# Altium project QUTMS_PDM.PrjPcb
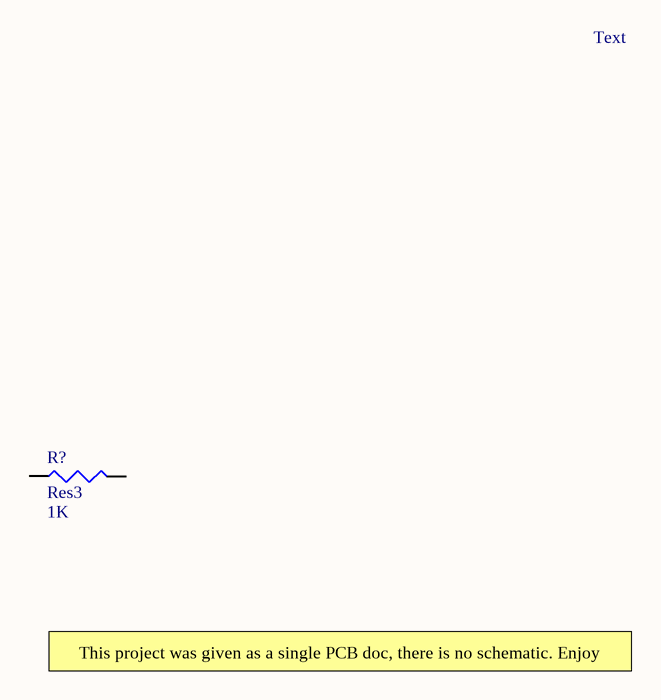
[diagram p0: PDMTest.SchDoc]
5 sheets, 42 parts. Net scope: flat (ports and power ports of the same name join across sheets).
Board file: PMM_MSPC_22A.PcbDoc
Sheets:
  PDMTest.SchDoc
  MCU.SchDoc
  Outputs.SchDoc
  CANBUS.SchDoc
  Power.SchDoc

## Sheet PDMTest.SchDoc
size A4

### Parts
R?  Res3  value 1K  [12Z-2010]

### Nets

Not connected (* = marked no-connect by the designer): R? 1 2

### Notes on the sheet
- Text
- This project was given as a single PCB doc, there is no schematic. Enjoy

### Library data of the parts
R? = Res3: Resistor; Published: 8-Jun-2000; LatestRevisionDate: 29-May-2009; LatestRevisionNote: IPC-7351 Footprint Added.; PackageReference: J1-0603; Publisher: Altium Limited; PackageDescription: Chip Resistor

## Sheet MCU.SchDoc
size A4
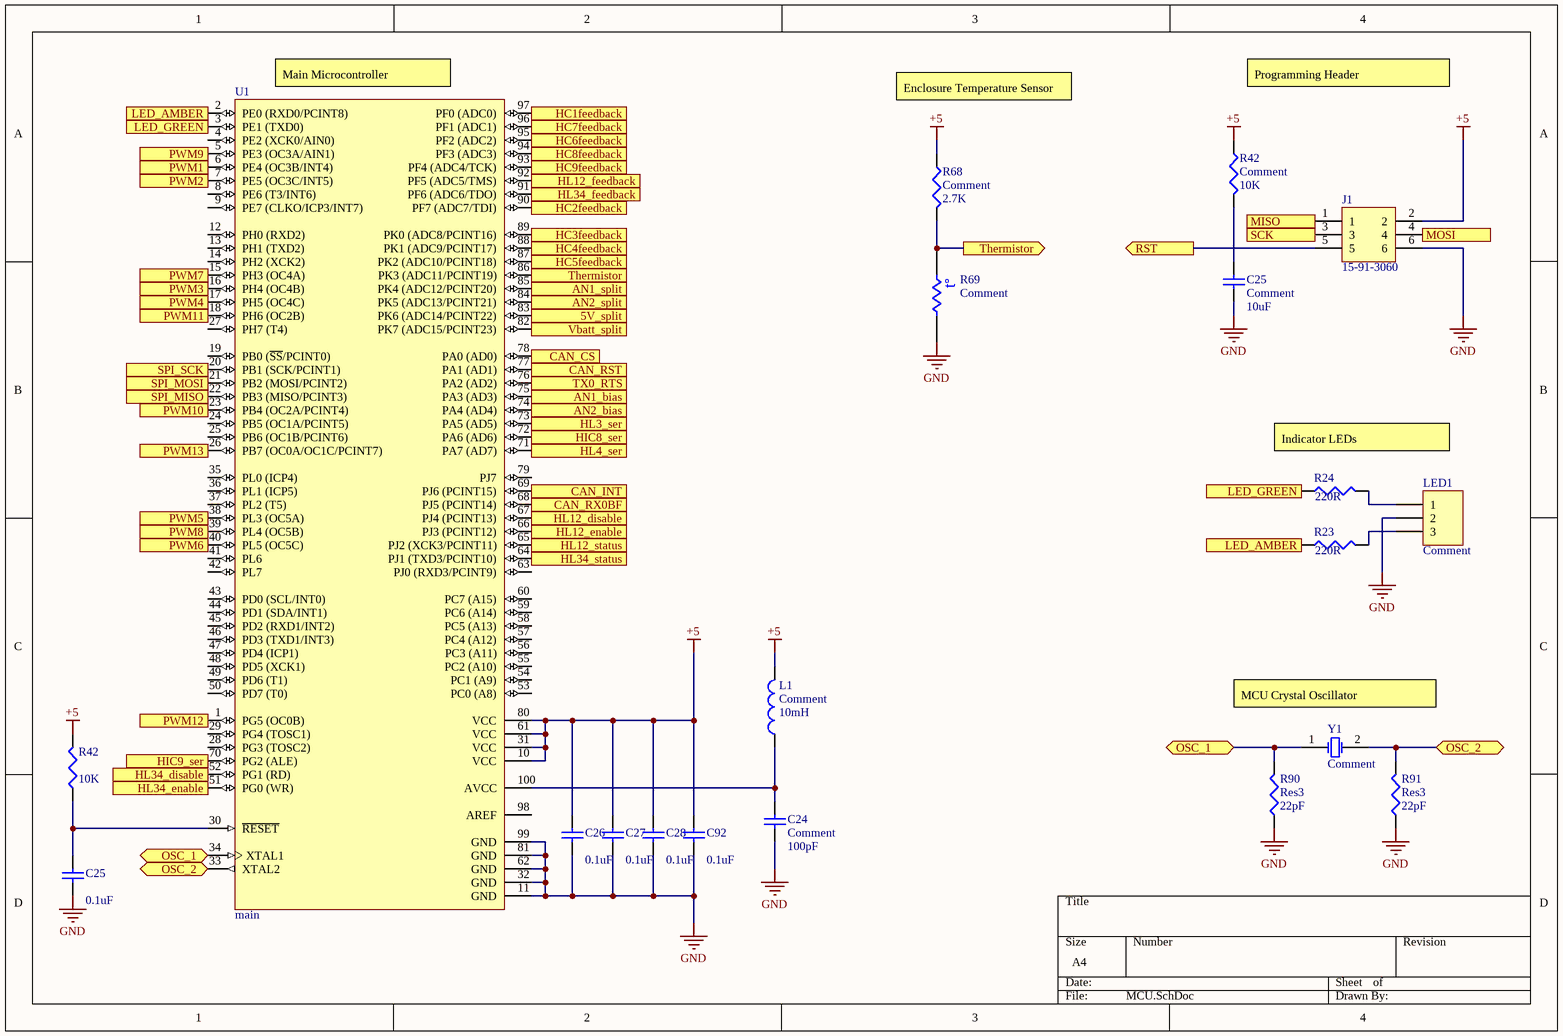
[diagram p1: MCU.SchDoc]

### Parts
(Parts that share a designator on the sheet are numbered #1, #2 ... from top to bottom, then left to right.)
C24  Comment  value 100pF  [J1-0603]
C25#1  Comment  value 10uF  [J1-0603]
C25#2  value 0.1uF  [0402]  (hidden comment: Cap Semi)
C26  value 0.1uF  [J1-0603]  (hidden comment: Comment)
C27  value 0.1uF  [J1-0603]  (hidden comment: Comment)
C28  value 0.1uF  [J1-0603]  (hidden comment: Comment)
C92  value 0.1uF  [J1-0603]  (hidden comment: Comment)
J1  15-91-3060  [SOT23-6]
L1  Comment  value 10mH  [2012[0805]]
LED1  Comment  [369-03]
R23  value 220R  [2012[0805]]  (hidden comment: Comment)
R24  value 220R  [2012[0805]]  (hidden comment: Comment)
R42#1  Comment  value 10K  [2012[0805]]
R42#2  value 10K  [12Z-2010]  (hidden comment: Res3)
R68  Comment  value 2.7K  [2012[0805]]
R69  Comment  [2012[0805]]
R90  Res3  value 22pF  [12Z-2010]
R91  Res3  value 22pF  [J1-0603]
U1  main  [SOT407-1_L]
Y1  Comment  [2012[0805]]

### Ports
5V_split (in), AN1_bias, AN1_split (in), AN2_bias, AN2_split (in), CAN_CS (out), CAN_INT (in), CAN_RST (out), CAN_RX0BF (in), HC1feedback (in), HC2feedback (in), HC3feedback (in), HC4feedback (in), HC5feedback (in), HC6feedback (in), HC7feedback (in), HC8feedback (in), HC9feedback (in), HIC8_ser, HIC9_ser, HL3_ser, HL4_ser, HL12_disable (out), HL12_enable (out), HL12_feedback (in), HL12_status (in), HL34_disable (out), HL34_enable (out), HL34_feedback (in), HL34_status (in), LED_AMBER (in), LED_AMBER (out), LED_GREEN (in), LED_GREEN (out), MISO (in), MOSI (out), OSC_1 (bidir), OSC_2 (bidir), PWM1 (out), PWM2 (out), PWM3 (out), PWM4 (out), PWM5 (out), PWM6 (out), PWM7 (out), PWM8 (out), PWM9 (out), PWM10 (out), PWM11 (out), PWM12 (out), PWM13 (out), RST (out), SCK (out), SPI_MISO (in), SPI_MOSI (out), SPI_SCK, Thermistor (in), Thermistor (out), TX0_RTS, Vbatt_split (in)

### Nets
+5: C26.2 C27.2 C28.2 C92.1 J1.2 L1.1 R42#1.1 R42#2.2 R68.2 U1.10(VCC) U1.31(VCC) U1.61(VCC) U1.80(VCC)
GND: C24.1 C25#1.1 C25#2.1 C26.1 C27.1 C28.1 C92.2 J1.6 LED1.2 R69.2 R90.1 R91.1 U1.11(GND) U1.32(GND) U1.62(GND) U1.81(GND) U1.99(GND)
NetC24_2: C24.2 L1.2 U1.100(AVCC)
NetC25#1_2: C25#1.2 R42#1.2
NetC25#2_2: C25#2.2 R42#2.1 U1.30(~{RESET})
NetJ1_1: J1.1 ; port MISO
NetJ1_3: J1.3 ; port SCK
NetJ1_4: J1.4 ; port MOSI
NetJ1_5: J1.5 ; port RST
NetLED1_1: LED1.1 R24.2
NetLED1_3: LED1.3 R23.2
NetR23_1: R23.1 U1.2(PE0_(RXD0/PCINT8)) ; port LED_AMBER
NetR24_1: R24.1 U1.3(PE1_(TXD0)) ; port LED_GREEN
NetR30_2: U1.68(PJ5_(PCINT14)) ; port CAN_RX0BF
NetR31_2: U1.69(PJ6_(PCINT15)) ; port CAN_INT
NetR32_1: U1.20(PB1_(SCK/PCINT1)) ; port SPI_SCK
NetR33_1: U1.21(PB2_(MOSI/PCINT2)) ; port SPI_MOSI
NetR34_1: U1.22(PB3_(MISO/PCINT3)) ; port SPI_MISO
NetR35_1: U1.78(PA0_(AD0)) ; port CAN_CS
NetR68_1: R68.1 R69.1 U1.86(PK3_(ADC11/PCINT19)) ; port Thermistor
NetR90_2: R90.2 U1.34(XTAL1) Y1.1(OSC1) ; port OSC_1
NetR91_2: R91.2 U1.33(XTAL2) Y1.2(OSC2) ; port OSC_2
NetU1_1: U1.1(PG5_(OC0B)) ; port PWM12
NetU1_5: U1.5(PE3_(OC3A/AIN1)) ; port PWM9
NetU1_6: U1.6(PE4_(OC3B/INT4)) ; port PWM1
NetU1_7: U1.7(PE5_(OC3C/INT5)) ; port PWM2
NetU1_15: U1.15(PH3_(OC4A)) ; port PWM7
NetU1_16: U1.16(PH4_(OC4B)) ; port PWM3
NetU1_17: U1.17(PH5_(OC4C)) ; port PWM4
NetU1_18: U1.18(PH6_(OC2B)) ; port PWM11
NetU1_23: U1.23(PB4_(OC2A/PCINT4)) ; port PWM10
NetU1_26: U1.26(PB7_(OC0A/OC1C/PCINT7)) ; port PWM13
NetU1_38: U1.38(PL3_(OC5A)) ; port PWM5
NetU1_39: U1.39(PL4_(OC5B)) ; port PWM8
NetU1_40: U1.40(PL5_(OC5C)) ; port PWM6
NetU1_51: U1.51(PG0_(WR)) ; port HL34_enable
NetU1_52: U1.52(PG1_(RD)) ; port HL34_disable
NetU1_64: U1.64(PJ1_(TXD3/PCINT10)) ; port HL34_status
NetU1_65: U1.65(PJ2_(XCK3/PCINT11)) ; port HL12_status
NetU1_66: U1.66(PJ3_(PCINT12)) ; port HL12_enable
NetU1_67: U1.67(PJ4_(PCINT13)) ; port HL12_disable
NetU1_70: U1.70(PG2_(ALE)) ; port HIC9_ser
NetU1_71: U1.71(PA7_(AD7)) ; port HL4_ser
NetU1_72: U1.72(PA6_(AD6)) ; port HIC8_ser
NetU1_73: U1.73(PA5_(AD5)) ; port HL3_ser
NetU1_74: U1.74(PA4_(AD4)) ; port AN2_bias
NetU1_75: U1.75(PA3_(AD3)) ; port AN1_bias
NetU1_76: U1.76(PA2_(AD2)) ; port TX0_RTS
NetU1_77: U1.77(PA1_(AD1)) ; port CAN_RST
NetU1_82: U1.82(PK7_(ADC15/PCINT23)) ; port Vbatt_split
NetU1_83: U1.83(PK6_(ADC14/PCINT22)) ; port 5V_split
NetU1_84: U1.84(PK5_(ADC13/PCINT21)) ; port AN2_split
NetU1_85: U1.85(PK4_(ADC12/PCINT20)) ; port AN1_split
NetU1_87: U1.87(PK2_(ADC10/PCINT18)) ; port HC5feedback
NetU1_88: U1.88(PK1_(ADC9/PCINT17)) ; port HC4feedback
NetU1_89: U1.89(PK0_(ADC8/PCINT16)) ; port HC3feedback
NetU1_90: U1.90(PF7_(ADC7/TDI)) ; port HC2feedback
NetU1_91: U1.91(PF6_(ADC6/TDO)) ; port HL34_feedback
NetU1_92: U1.92(PF5_(ADC5/TMS)) ; port HL12_feedback
NetU1_93: U1.93(PF4_(ADC4/TCK)) ; port HC9feedback
NetU1_94: U1.94(PF3_(ADC3)) ; port HC8feedback
NetU1_95: U1.95(PF2_(ADC2)) ; port HC6feedback
NetU1_96: U1.96(PF1_(ADC1)) ; port HC7feedback
NetU1_97: U1.97(PF0_(ADC0)) ; port HC1feedback

Not connected (* = marked no-connect by the designer): U1 4(PE2_(XCK0/AIN0)) 8(PE6_(T3/INT6)) 9(PE7_(CLKO/ICP3/INT7)) 12(PH0_(RXD2)) 13(PH1_(TXD2)) 14(PH2_(XCK2)) 19(PB0_(~{SS}/PCINT0)) 24(PB5_(OC1A/PCINT5)) 25(PB6_(OC1B/PCINT6)) 27(PH7_(T4)) 28(PG3_(TOSC2)) 29(PG4_(TOSC1)) 35(PL0_(ICP4)) 36(PL1_(ICP5)) 37(PL2_(T5)) 41(PL6) 42(PL7) 43(PD0_(SCL/INT0)) 44(PD1_(SDA/INT1)) 45(PD2_(RXD1/INT2)) 46(PD3_(TXD1/INT3)) 47(PD4_(ICP1)) 48(PD5_(XCK1)) 49(PD6_(T1)) 50(PD7_(T0)) 53(PC0_(A8)) 54(PC1_(A9)) 55(PC2_(A10)) 56(PC3_(A11)) 57(PC4_(A12)) 58(PC5_(A13)) 59(PC6_(A14)) 60(PC7_(A15)) 63(PJ0_(RXD3/PCINT9)) 79(PJ7) 98(AREF)

### Notes on the sheet
- (near U1) Main Microcontroller
- Enclosure Temperature Sensor
- Programming Header
- Indicator LEDs
- (near Y1) MCU Crystal Oscillator
- (in symbol Res Thermal) t°

### Library data of the parts
C24 C25#1 C25#2 C26-C28 C92 = Cap Semi: Capacitor (Semiconductor SIM Model); Published: 8-Jun-2000; LatestRevisionDate: 29-May-2009; LatestRevisionNote: IPC-7351 Footprint Added.; PackageReference: C1206; Publisher: Altium Limited; PackageDescription: Chip Capacitor
J1 = Header 3X2: Header, 3-Pin, Dual row; LatestRevisionDate: 17-Jul-2002; LatestRevisionNote: Re-released for DXP Platform.; Publisher: Altium Limited
L1 = Inductor: Code_IEC: 1005; Published: 8-Jun-2000; LatestRevisionDate: 29-May-2009; LatestRevisionNote: IPC-7351 Footprint Added.; PackageReference: 0402-A; Publisher: Altium Limited; PackageDescription: Chip Inductor; Code_JEITA: 0402
LED1 = Header 3: Header, 3-Pin; LatestRevisionDate: 17-Jul-2002; LatestRevisionNote: Re-released for DXP Platform.; Publisher: Altium Limited
R23 R24 R42#1 R42#2 R68 R90 R91 = Res3: Resistor; Published: 8-Jun-2000; LatestRevisionDate: 29-May-2009; LatestRevisionNote: IPC-7351 Footprint Added.; PackageReference: J1-0603; Publisher: Altium Limited; PackageDescription: Chip Resistor
R69 = Res Thermal: Published: 24-Mar-1999; LatestRevisionDate: 29-May-2009; LatestRevisionNote: IPC-7351 Footprint Added.; PackageVersion: Mar-2003; PackageReference: 6-0805; Publisher: Altium Limited; PackageDescription: Chip Resistor 0805 Case Size; Code_IPC: RESC2012
U1 = CMP-0095-00211-2: 8-bit AVR Microcontroller, 2.7-5.5V, 8MHz, 128KB Flash, 4KB EEPROM, 8KB SRAM, 86 GPIO pins, 100-pin TQFP, Industrial Grade (-40°C to 85°C), Pb-Free; PackageReference: 100A; DatasheetVersion: revN, May-2011; PackageVersion: revD, Oct-2010; Code_JEDEC: MS-026-AED; ComponentLink2URL: http://www.atmel.com/dyn/resources/prod_documents/doc2549.pdf; ComponentLink1Description: Manufacturer URL; ComponentLink2Description: ATmega640/1280/1281/2560/2561 Datasheet; ComponentLink3Description: ATmega640/1280/1281/2560/2561 Summary; RevisionNote: DatasheetVersion & PackageVersion updated. URLs added.; ComponentLink3URL: http://www.atmel.com/dyn/resources/prod_documents/2549S.pdf; ComponentLink1URL: http://www.atmel.com/; PackageDescription: 100-Pin Thin Profile Plastic Quad Flat Pack (TQFP), 14 x 14 x 1.0 mm Body, 0.5 mm Pitch
Y1 = XTAL: Crystal Oscillator; Published: 8-Jun-2000; LatestRevisionDate: 17-Jul-2002; LatestRevisionNote: Re-released for DXP Platform.; PackageReference: R38; Publisher: Altium Limited; PackageDescription: Crystal, Thru-Hole; 2 Leads; Body 3.1 x 8.2 mm (Dia.xH)

## Sheet Outputs.SchDoc
size A4
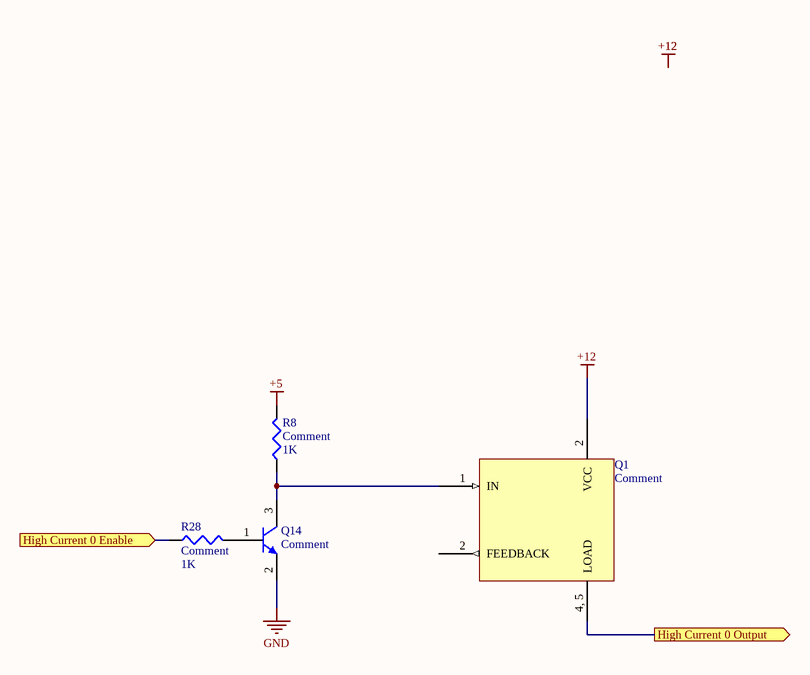
[diagram p2: Outputs.SchDoc]

### Parts
Q1  Comment
Q14  Comment  [SOT23A]
R8  Comment  value 1K  [2012[0805]]
R28  Comment  value 1K  [2012[0805]]

### Ports
High Current 0 Enable (in), High Current 0 Output (out)

### Nets
+5: R8.1
+12: Q1.2(FEEDBACK)
GND: Q14.2(E)
NetQ1_1: Q1.1(IN) Q14.3(C) R8.2
NetQ1_4, 5: Q1.4,_5(LOAD) ; port High Current 0 Output
NetQ14_1: Q14.1(B) R28.2
NetR28_1: R28.1 ; port High Current 0 Enable

### Library data of the parts
Q1 = AUIR3313STRL
Q14 = CMP-1048-00538-1: General Purpose Transistor, NPN Silicon, 3-Pin SOT-23, Pb-Free, Tape and Reel; Manufacturer: On Semiconductor; PartNumber: MMBT2222ALT1G; fT Min (MHz): 300; IC Continuous (A): 0.6; ComponentLink3URL: http://www.onsemi.cn/pub_link/Collateral/318-08.PDF; RoHS: TRUE; ComponentLink1URL: http://www.onsemi.com/; ComponentLink3Description: Package Specification; ComponentLink2Description: Datasheet; Mounting Technology: Surface Mount; Packing: Tape and Reel; PackageDescription: 3-Pin Small Outline Transistor, Body 2.92 x 1.3 mm, Pitch 0.95 mm; DatasheetVersion: Rev. 10; PackageReference: SOT-23-3-318-08; ComponentLink2URL: http://www.onsemi.cn/pub_link/Collateral/MMBT2222LT1-D.PDF; Polarity: NPN; PackageVersion: Rev. AP, 11/2009; ComponentLink1Description: Manufacturer URL
R8 R28 = Res3: Resistor; Published: 8-Jun-2000; LatestRevisionDate: 29-May-2009; LatestRevisionNote: IPC-7351 Footprint Added.; PackageReference: J1-0603; Publisher: Altium Limited; PackageDescription: Chip Resistor

## Sheet CANBUS.SchDoc
size A4
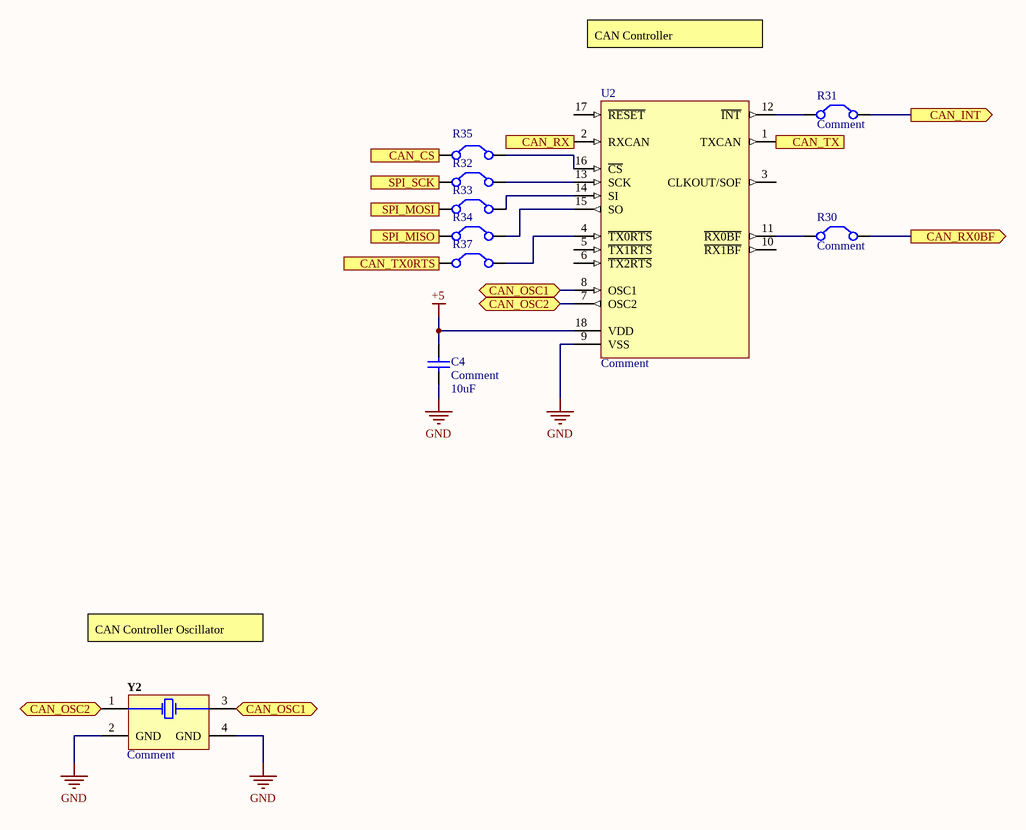
[diagram p3: CANBUS.SchDoc]

### Parts
C4  Comment  value 10uF  [J1-0603]
R30  Comment  [2012[0805]]
R31  Comment  [2012[0805]]
R32  Comment  [2012[0805]]  (value not drawn)
R33  Comment  [2012[0805]]  (value not drawn)
R34  Comment  [2012[0805]]  (value not drawn)
R35  Comment  [2012[0805]]  (value not drawn)
R37  Comment  [2012[0805]]  (value not drawn)
U2  Comment  [SOL-18_N]
Y2  Comment  [SOT223]

### Ports
CAN_CS (in), CAN_INT (out), CAN_OSC1 (bidir), CAN_OSC2 (bidir), CAN_RX0BF (out), CAN_RX (in), CAN_TX0RTS (in), CAN_TX (out), SPI_MISO (in), SPI_MOSI (in), SPI_SCK (in)

### Nets
+5: C4.2 U2.18(VDD)
GND: C4.2 U2.9(VSS) Y2.2(GND) Y2.4(GND)
NetR30_1: R30.1(C1) U2.11(~{RX0BF})
NetR30_2: R30.2(C2) ; port CAN_RX0BF
NetR31_1: R31.1(C1) U2.12(~{INT})
NetR31_2: R31.2(C2) ; port CAN_INT
NetR32_1: R32.1(C1) ; port SPI_SCK
NetR32_2: R32.2(C2) U2.13(SCK)
NetR33_1: R33.1(C1) ; port SPI_MOSI
NetR33_2: R33.2(C2) U2.14(SI)
NetR34_1: R34.1(C1) ; port SPI_MISO
NetR34_2: R34.2(C2) U2.15(SO)
NetR35_1: R35.1(C1) ; port CAN_CS
NetR35_2: R35.2(C2) U2.16(~{CS})
NetR37_1: R37.1(C1) ; port CAN_TX0RTS
NetR37_2: R37.2(C2) U2.4(~{TX0RTS})
NetU2_1: U2.1(TXCAN) ; port CAN_TX
NetU2_2: U2.2(RXCAN) ; port CAN_RX
NetU2_7: U2.7(OSC2) Y2.1(X1) ; port CAN_OSC2
NetU2_8: U2.8(OSC1) Y2.3(X2) ; port CAN_OSC1

Not connected (* = marked no-connect by the designer): U2 3(CLKOUT/SOF) 5(~{TX1RTS}) 6(~{TX2RTS}) 10(~{RX1BF}) 17(~{RESET})

### Notes on the sheet
- CAN Controller
- CAN Controller Oscillator

### Library data of the parts
C4 = Cap Semi: Capacitor (Semiconductor SIM Model); Published: 8-Jun-2000; LatestRevisionDate: 29-May-2009; LatestRevisionNote: IPC-7351 Footprint Added.; PackageReference: C1206; Publisher: Altium Limited; PackageDescription: Chip Capacitor
R30-R35 R37 = Jumper: Jumper Wire; Published: 24-Mar-1999; LatestRevisionDate: 17-Jul-2002; LatestRevisionNote: Re-released for DXP Platform.; PackageReference: RAD-0.2; Publisher: Altium Limited; PackageDescription: Radial Cap, Thru-Hole; 2 Leads; 0.2 in Pin Spacing
U2 = CMP-0186-00133-2: Stand-Alone CAN Controller With SPI Interface, 18-Pin SOIC, Industrial Temperature; ComponentLink2Description: Datasheet; RevisionNote: URLs added. DatasheetVersion updated.; PackageVersion: revBB, Aug-2009; ComponentLink1URL: http://www.microchip.com/; PackageReference: SOIC-SO18; PackageDescription: 18-Lead Plastic Small Outline (SO) - Wide 7.50mm Body [SOIC]; DatasheetVersion: revF, Oct-2010; ComponentLink2URL: http://ww1.microchip.com/downloads/en/DeviceDoc/21801f.pdf; ComponentLink3URL: http://www.microchip.com/stellent/groups/techpub_sg/documents/packagingspec/en012702.pdf; Code_JEDEC: MS-013; ComponentLink3Description: Package Specification; ComponentLink1Description: Manufacturer URL
Y2 = CMP-2000-05693-1: SMD Seam Crystal, 20 MHz, +/- 10 ppm, 10 pF, -20 to 70 degC, 4-Pin SMD, RoHS, Tape and Reel; Manufacturer: TXC; Load Capacitance: 10pF; Operating Mode: Fundamental; Frequency Tolerance: ±10ppm; Frequency: 20MHz; Catalog Drawings: 7BSeriesTop / 7BSeriesBottom / 7BSeriesSide1 / 7BSeriesSide2 / 7BSeriesCircuit; ESR (Equivalent Series Resistance): 40Ohm; Other Names: 887-1303-1; Dynamic Catalog: 7BSeries; Category: CrystalsandOscillators; Datasheet Version: 02/2010; Type: MHzCrystal; Package / Case: 4-SMD,NoLead(DFN,LCC); Mounting Technology: SurfaceMount; Mounting Type: SurfaceMount; Package Description: 4-Pin Surface Mount Device, Body 5 x 3.2 mm, Pitch 3.7 mm; Packaging: CutTape(CT); Package Reference: 7B-4; Operating Temperature: -20°C~70°C; Series: 7B; Height: 0.041"(1.05mm); Manufacturer URL: http://www.txccorp.com/; Size / Dimension: 0.197"Lx0.126"W(5.00mmx3.20mm); Frequency Stability: ±10ppm; Standard Package: 1; Family: Crystals; Datasheet URL: http://www.txccrystal.com/images/pdf/7b-accuracy.pdf

## Sheet Power.SchDoc
size A4
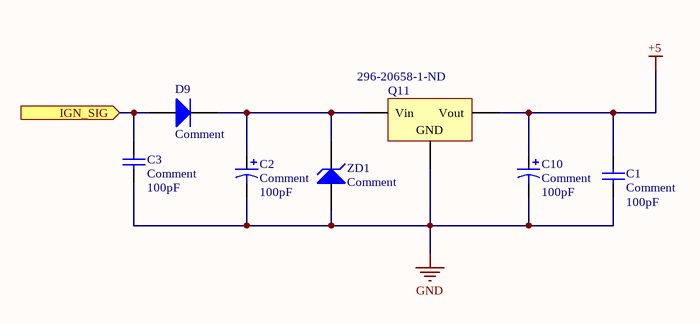
[diagram p4: Power.SchDoc]

### Parts
C1  Comment  value 100pF  [J1-0603]
C2  Comment  value 100pF  [6332[2512]]
C3  Comment  value 100pF  [J1-0603]
C10  Comment  value 100pF  [6332[2512]]
D9  Comment  [SMC]
Q11  Supplier Part Number 1: 296-20658-1-ND  [369A-13]
ZD1  Comment  [SMC]

### Ports
IGN_SIG (in)

### Nets
+5: C1.1 C10.1 Q11.3(Vout)
GND: C1.2 C2.2 C3.1 C10.2 Q11.2(GND) ZD1.1(A)
NetC2_1: C2.1 D9.2(K) Q11.1(Vin) ZD1.2(K)
NetC3_2: C3.2 D9.1(A) ; port IGN_SIG

### Library data of the parts
C1 C3 = Cap Semi: Capacitor (Semiconductor SIM Model); Published: 8-Jun-2000; LatestRevisionDate: 29-May-2009; LatestRevisionNote: IPC-7351 Footprint Added.; PackageReference: C1206; Publisher: Altium Limited; PackageDescription: Chip Capacitor
C2 C10 = Cap Pol3: Polarized Capacitor (Surface Mount); Published: 8-Jun-2000; LatestRevisionDate: 29-May-2009; LatestRevisionNote: IPC-7351 Footprint Added.; PackageReference: C0805; Publisher: Altium Limited; PackageDescription: Chip Capacitor
D9 = Diode: Default Diode; Published: 8-Jun-2000; LatestRevisionDate: 17-Jul-2002; LatestRevisionNote: Re-released for DXP Platform.; PackageVersion: Sep-1996; PackageReference: SMC; Publisher: Altium Limited; PackageDescription: DO-214-AB/SMC; 2 C-Bend Leads; Body 7.9 x 5.9 mm, inc. leads (LxW); Code_JEDEC: DO-214-AB
Q11 = Volt Reg: Voltage Regulator; Published: 24-Mar-1999; LatestRevisionDate: 29-May-2009; LatestRevisionNote: IPC-7351 Footprint Added.; PackageReference: D2PAK; Publisher: Altium Limited; PackageDescription: 3-Pin Transistor Outline Package 2.54 mm Pitch, 15.1 mm Lead Span; Supplier 1: Digi-Key
ZD1 = D Zener: Zener Diode; Published: 8-Jun-2000; LatestRevisionDate: 17-Jul-2002; LatestRevisionNote: Re-released for DXP Platform.; PackageReference: DIODE-0.7; Publisher: Altium Limited; PackageDescription: Diode, Thru-Hole; 2 Leads; 0.7 in Pin Spacing

## Nets that join several sheets
+5: MCU (13 pins), Outputs (R8.1), CANBUS (C4.2 U2.18), Power (C1.1 C10.1 Q11.3)
GND: MCU (17 pins), Outputs (Q14.2), CANBUS (C4.2 U2.9 Y2.2 Y2.4), Power (6 pins)
NetR30_2: MCU (U1.68), CANBUS (R30.2)
NetR31_2: MCU (U1.69), CANBUS (R31.2)
NetR32_1: MCU (U1.20), CANBUS (R32.1)
NetR33_1: MCU (U1.21), CANBUS (R33.1)
NetR34_1: MCU (U1.22), CANBUS (R34.1)
NetR35_1: MCU (U1.78), CANBUS (R35.1)